# Altium schematic sheet DMB.SchDoc
size A3; SheetNumber: 1; SheetTotal: 2
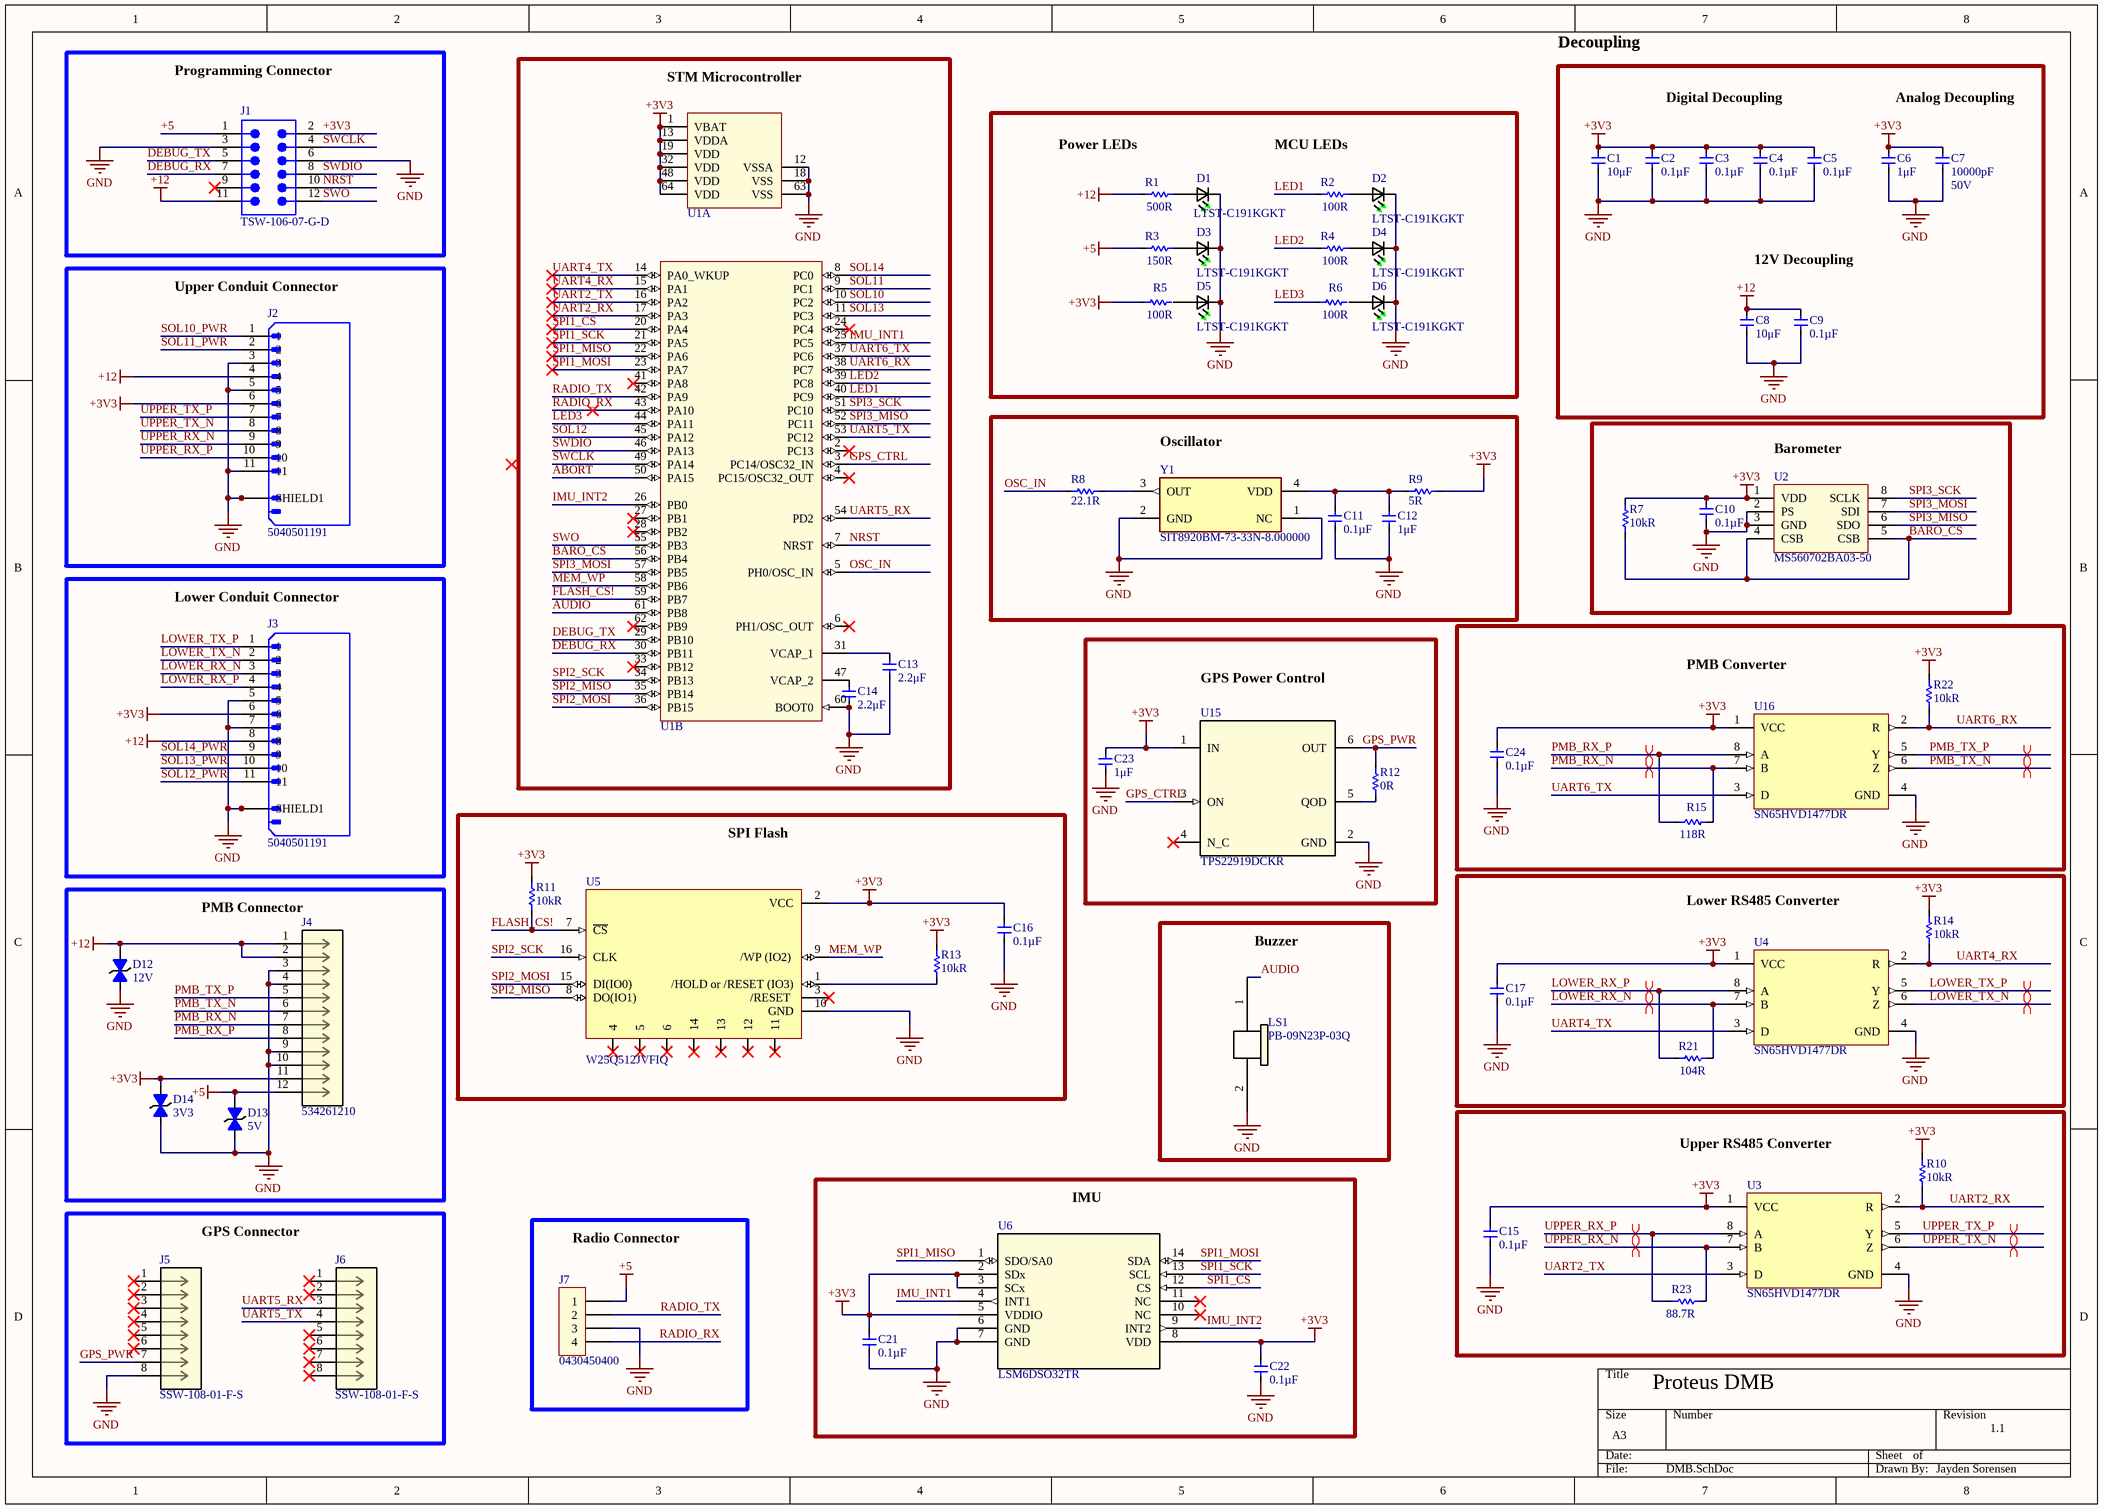
[diagram p0: DMB.SchDoc]

## Parts
C1  10μF  [0603]
C2  Capacitance: 0.1µF  [0603]  (hidden comment: CGA3E2X7R1E104K080AA)
C3  Capacitance: 0.1µF  [0603]  (hidden comment: CGA3E2X7R1E104K080AA)
C4  Capacitance: 0.1µF  [0603]  (hidden comment: CGA3E2X7R1E104K080AA)
C5  Capacitance: 0.1µF  [0603]  (hidden comment: CGA3E2X7R1E104K080AA)
C6  1μF  [0603]
C7  Capacitance: 10000pF  Voltage - Rated: 50V  [0603]  (hidden comment: CGA3E2X7R1H103K080AA)
C8  10μF  [0603]
C9  Capacitance: 0.1µF  [0603]  (hidden comment: CGA3E2X7R1E104K080AA)
C10  Capacitance: 0.1µF  [0603]  (hidden comment: CGA3E2X7R1E104K080AA)
C11  Capacitance: 0.1µF  [0603]  (hidden comment: CGA3E2X7R1E104K080AA)
C12  1μF  [0603]
C13  2.2μF  [0603]
C14  2.2μF  [0603]
C15  Capacitance: 0.1µF  [0603]  (hidden comment: CGA3E2X7R1E104K080AA)
C16  Capacitance: 0.1µF  [0603]  (hidden comment: CGA3E2X7R1E104K080AA)
C17  Capacitance: 0.1µF  [0603]  (hidden comment: CGA3E2X7R1E104K080AA)
C21  Capacitance: 0.1µF  [0603]  (hidden comment: CGA3E2X7R1E104K080AA)
C22  Capacitance: 0.1µF  [0603]  (hidden comment: CGA3E2X7R1E104K080AA)
C23  1μF  [0603]
C24  Capacitance: 0.1µF  [0603]  (hidden comment: CGA3E2X7R1E104K080AA)
D1  LTST-C191KGKT  [LED_LTST-C191KGKT_LTO]
D2  LTST-C191KGKT  [LED_LTST-C191KGKT_LTO]
D3  LTST-C191KGKT  [LED_LTST-C191KGKT_LTO]
D4  LTST-C191KGKT  [LED_LTST-C191KGKT_LTO]
D5  LTST-C191KGKT  [LED_LTST-C191KGKT_LTO]
D6  LTST-C191KGKT  [LED_LTST-C191KGKT_LTO]
D12  12V  [SOD-323-2]
D13  5V  [SOD-323-2]
D14  3V3  [SOD-323-2]
J1  TSW-106-07-G-D  [SMTC-TSW-106-07-X-D]
J2  5040501191  [MOLEX_5040501191]
J3  5040501191  [MOLEX_5040501191]
J4  534261210  [2159321270]
J5  SSW-108-01-F-S  [CON8_1X8_TU_SSQ]
J6  SSW-108-01-F-S  [CON8_1X8_TU_SSQ]
J7  0430450400  [0430450400]
LS1  PB-09N23P-03Q  [PB-09N23P-03Q]
R1  500R  [0603]
R2  100R  [0603]
R3  150R  [0603]
R4  100R  [0603]
R5  100R  [0603]
R6  100R  [0603]
R7  10kR  [0603]
R8  22.1R  [0603]
R9  Resistance: 5R  [BO_PWR2010]  (hidden comment: PWR2010W5R00JE)
R10  10kR  [0603]
R11  10kR  [0603]
R12  0R  [0603]
R13  10kR  [0603]
R14  10kR  [0603]
R15  118R  [0603]
R21  104R  [0603]
R22  10kR  [0603]
R23  88.7R  [0603]
U1  STM32F405RGT6  [TSQFP50P1200X1200X160-64N]  (value not drawn)  (parts A,B of 2)
U2  MS560702BA03-50  [TECO-MS560702BA03-50_V]
U3  SN65HVD1477DR  [SOIC127P600X175-8N]
U4  SN65HVD1477DR  [SOIC127P600X175-8N]
U5  W25Q512JVFIQ  [SOIC127P1030X265-16N]
U6  LSM6DSO32TR  [LSM6DSO32TR]
U15  TPS22919DCKR  [SC-70-6]
U16  SN65HVD1477DR  [SOIC127P600X175-8N]
Y1  SIT8920BM-73-33N-8.000000  [FP-SIT8920BM-73-33N-8_000-MFG]

## Blocks framed on the sheet
Programming Connector: J1
STM Microcontroller: C13 C14 U1
Decoupling: C1-C9
Upper Conduit Connector: J2
Oscillator: C11 C12 R8 R9 Y1
Barometer: C10 R7 U2
Lower Conduit Connector: J3
GPS Power Control: C23 R12 U15
PMB Converter: C24 R15 R22 U16
SPI Flash: C16 R11 R13 U5
Lower RS485 Converter: C17 R14 R21 U4
PMB Connector: D12-D14 J4
Buzzer: LS1
Upper RS485 Converter: C15 R10 R23 U3
IMU: C21 C22 U6
GPS Connector: J5 J6
Radio Connector: J7

## Nets
+3V3: C1.2 C2.2 C3.2 C4.2 C5.2 C6.2 C7.2 C10.2 C15.2 C16.2 C17.2 C21.2 C22.2 C23.2 C24.2 D14.1 J1.2 J2.6 J3.6 J4.11 R5.1 R7.2 R9.2 R10.2 R11.2 R13.2 R14.2 R22.2 U1.1(VBAT) U1.13(VDDA) U1.19(VDD) U1.32(VDD) U1.48(VDD) U1.64(VDD) U2.1(VDD) U3.1(VCC) U4.1(VCC) U5.2(VCC) U6.2(SDx) U6.3(SCx) U6.5(VDDIO) U6.8(VDD) U15.1(IN) U16.1(VCC)
+5: D13.2 J1.1 J4.12 J7.1 R3.1
+12: C8.2 C9.2 D12.2 J1.11 J2.4 J3.8 J4.1 J4.2 R1.1
GND: C1.1 C2.1 C3.1 C4.1 C5.1 C6.1 C7.1 C8.1 C9.1 C10.1 C11.1 C12.1 C13.1 C14.1 C15.1 C16.1 C17.1 C21.1 C22.1 C23.1 C24.1 D1.1(K2) D2.1(K2) D3.1(K2) D4.1(K2) D5.1(K2) D6.1(K2) D12.1 D13.1 D14.2 J1.3 J1.6 J2.3 J2.5 J2.11 J2.S1(SHIELD1) J2.S2(SHIELD1) J3.5 J3.7 J3.S1(SHIELD1) J3.S2(SHIELD1) J4.3 J4.4 J4.9 J4.10 J5.8 J7.3 LS1.2 U1.12(VSSA) U1.18(VSS) U1.60(BOOT0) U1.63(VSS) U2.2(PS) U2.3(GND) U3.4(GND) U4.4(GND) U5.10(GND) U6.6(GND) U6.7(GND) U15.2(GND) U16.4(GND) Y1.1(NC) Y1.2(GND)
ABORT: U1.50(PA15)
AUDIO: LS1.1 U1.61(PB8)
BARO_~{CS}: R7.1 U1.56(PB4) U2.4(CSB) U2.5(CSB)
DEBUG_RX: J1.7 U1.30(PB11)
DEBUG_TX: J1.5 U1.29(PB10)
FLASH_CS!: R11.1 U1.59(PB7) U5.7(~{CS})
GPS_CTRL: U1.3(PC14/OSC32_IN) U15.3(ON)
GPS_PWR: J5.7 R12.2 U15.6(OUT)
IMU_INT1: U1.25(PC5) U6.4(INT1)
IMU_INT2: U1.26(PB0) U6.9(INT2)
LED1: R2.1 U1.40(PC9)
LED2: R4.1 U1.39(PC8)
LED3: R6.1 U1.44(PA11)
LOWER_RX_N: J3.3 R21.2 U4.7(B)
LOWER_RX_P: J3.4 R21.1 U4.8(A)
LOWER_TX_N: J3.2 U4.6(Z)
LOWER_TX_P: J3.1 U4.5(Y)
MEM_WP: U1.58(PB6) U5.9(/WP_(IO2))
NRST: J1.10 U1.7(NRST)
OSC_IN: R8.1 U1.5(PH0/OSC_IN)
PMB_RX_N: J4.7 R15.2 U16.7(B)
PMB_RX_P: J4.8 R15.1 U16.8(A)
PMB_TX_N: J4.6 U16.6(Z)
PMB_TX_P: J4.5 U16.5(Y)
RADIO_RX: J7.4 U1.43(PA10)
RADIO_TX: J7.2 U1.42(PA9)
SOL10: U1.10(PC2)
SOL10_PWR: J2.1
SOL11: U1.9(PC1)
SOL11_PWR: J2.2
SOL12: U1.45(PA12)
SOL12_PWR: J3.11
SOL13: U1.11(PC3)
SOL13_PWR: J3.10
SOL14: U1.8(PC0)
SOL14_PWR: J3.9
SPI1_CS: U1.20(PA4) U6.12(CS)
SPI1_MISO: U1.22(PA6) U6.1(SDO/SA0)
SPI1_MOSI: U1.23(PA7) U6.14(SDA)
SPI1_SCK: U1.21(PA5) U6.13(SCL)
SPI2_MISO: U1.35(PB14) U5.8(DO(IO1))
SPI2_MOSI: U1.36(PB15) U5.15(DI(IO0))
SPI2_SCK: U1.34(PB13) U5.16(CLK)
SPI3_MISO: U1.52(PC11) U2.6(SDO)
SPI3_MOSI: U1.57(PB5) U2.7(SDI)
SPI3_SCK: U1.51(PC10) U2.8(SCLK)
SWCLK: J1.4 U1.49(PA14)
SWDIO: J1.8 U1.46(PA13)
SWO: J1.12 U1.55(PB3)
UART2_RX: R10.1 U1.17(PA3) U3.2(R)
UART2_TX: U1.16(PA2) U3.3(D)
UART4_RX: R14.1 U1.15(PA1) U4.2(R)
UART4_TX: U1.14(PA0_WKUP) U4.3(D)
UART5_RX: J6.3 U1.54(PD2)
UART5_TX: J6.4 U1.53(PC12)
UART6_RX: R22.1 U1.38(PC7) U16.2(R)
UART6_TX: U1.37(PC6) U16.3(D)
UPPER_RX_N: J2.9 R23.2 U3.7(B)
UPPER_RX_P: J2.10 R23.1 U3.8(A)
UPPER_TX_N: J2.8 U3.6(Z)
UPPER_TX_P: J2.7 U3.5(Y)
NetC11_2: C11.2 C12.2 R9.1 Y1.4(VDD)
NetC13_2: C13.2 U1.31(VCAP_1)
NetC14_2: C14.2 U1.47(VCAP_2)
NetD1_2: D1.2(A2) R1.2
NetD2_2: D2.2(A2) R2.2
NetD3_2: D3.2(A2) R3.2
NetD4_2: D4.2(A2) R4.2
NetD5_2: D5.2(A2) R5.2
NetD6_2: D6.2(A2) R6.2
NetR8_2: R8.2 Y1.3(OUT)
NetR12_1: R12.1 U15.5(QOD)
NetR13_1: R13.1 U5.1(/HOLD_or_/RESET_(IO3))

Not connected (* = marked no-connect by the designer): J1 9*; J5 1* 2* 3* 4* 5* 6*; J6 1* 2* 5* 6* 7* 8*; U1 2(PC13)* 4(PC15/OSC32_OUT)* 6(PH1/OSC_OUT)* 24(PC4)* 27(PB1)* 28(PB2)* 33(PB12)* 41(PA8)* 62(PB9)*; U5 3(/RESET_)* ?1(4)* ?2(5)* ?3(6)* ?4(11)* ?5(12)* ?6(13)* ?7(14)*; U6 10(NC)* 11(NC)*; U15 4(N_C)*

## Layout directives
differential pair; net class LOWER_TX; differential pair class CONDUIT: LOWER_TX_N, LOWER_TX_P, PMB_TX_N, PMB_TX_P
differential pair; net class UPPER_TX; differential pair class CONDUIT: UPPER_TX_N, UPPER_TX_P
differential pair; net class UPPER_RX; differential pair class CONDUIT: UPPER_RX_N, UPPER_RX_P
differential pair; net class LOWER_RX; differential pair class CONDUIT: LOWER_RX_N, LOWER_RX_P, PMB_RX_N, PMB_RX_P

## Notes on the sheet
- Digital Decoupling
- Analog Decoupling
- (near R1) Power LEDs
- MCU LEDs
- 12V Decoupling
- Proteus DMB
- 1.1
- Jayden Sorensen

## Library data of the parts
C1 C8 = CL10A106MP8NNNC: CAP CER 10UF 10V X5R 0603
C2-C5 C9-C11 C15-C17 C21 C22 C24 = CGA3E2X7R1E104K080AA: CAP CER 0.1UF 25V X7R 0603; Manufacturer: TDK Corporation; Tolerance: ±10%; Temperature Coefficient: X7R; Operating Temperature: -55°C ~ 125°C; Mounting Type: Surface Mount, MLCC; Package / Case: 0603 (1608 Metric); Size / Dimension: 0.063" L x 0.031" W (1.60mm x 0.80mm); Manufacturer Part Number: CGA3E2X7R1E104K080AA; Thickness (Max): 0.035" (0.90mm); ComponentLink1Description: Datasheet; ComponentLink1URL: https://product.tdk.com/info/en/catalog/spec/mlccspec_automotive_general_en.pdf; Supplier 1: Digi-Key; Supplier Part Number 1: 445-5667-1-ND
C6 C12 C23 = CL10A105KP8NNNC: CAP CER 1UF 10V X5R 0603
C7 = CGA3E2X7R1H103K080AA: CAP CER 10000PF 50V X7R 0603; Manufacturer: TDK Corporation; Tolerance: ±10%; Temperature Coefficient: X7R; Operating Temperature: -55°C ~ 125°C; Mounting Type: Surface Mount, MLCC; Package / Case: 0603 (1608 Metric); Size / Dimension: 0.063" L x 0.031" W (1.60mm x 0.80mm); Manufacturer Part Number: CGA3E2X7R1H103K080AA; Thickness (Max): 0.035" (0.90mm); ComponentLink1Description: Datasheet; ComponentLink1URL: https://product.tdk.com/info/en/catalog/spec/mlccspec_automotive_general_en.pdf; Supplier 1: Digi-Key; Supplier Part Number 1: 445-5662-1-ND
C13 C14 = C1608X5R1C225K080AB: CAP CER 2.2UF 16V X5R 0603
D1-D6 = LTST-C191KGKT: LED GREEN CLEAR SMD 0603
D12 = SD12C-01FTG: TVS 12V Working, 23V Clamp - ESD Suppressor Diode TVS Bi-Dir 12V Automotive 2-Pin SOD-323 T/R; Manufacturer: Littelfuse; Number of Bidirectional Channels: 1; Peak Pulse Power: 450W; Power Line Protection: No; Polarity: Bidirectional; Max Surge Current: 17A; Supplier 1: RSComponents; Supplier Part Number 1: 1719641; Manufacturer Part Number: SD12C-01FTG; RoHS: Yes; Category: TVS Diodes; Stock: 2350; Pricing: 25=0.37600, 100=0.31400, 500=0.30600, 1000=0.29900 (GBP); Mount: Surface Mount; Case/Package: SOD; Number of Pins: 2; Min Operating Temperature: -40°C; Max Operating Temperature: 125°C; Packaging: Tape and Reel; Reverse Standoff Voltage: 12V; Clamping Voltage: 23V; Termination: SMD/SMT; Working Voltage: 12V; Max Power Dissipation: 450W; Package Quantity: 3000; Peak Pulse Current: 17A; Resistor Type: Zener; RoHS Compliant: Yes; ComponentLink1URL: http://www.mouser.com/ds/2/240/littelfuse_SD-C_datasheet-341330.pdf?src-supplier=Mouser; ComponentLink1Description: http://www.mouser.com/ds/2/240/littelfuse_SD-C_datasheet-341330.pdf?src-supplier=Mouser; ComponentLink2URL: http://www.farnell.com/datasheets/2244591.pdf?src-supplier=Farnell; ComponentLink2Description: http://www.farnell.com/datasheets/2244591.pdf?src-supplier=Farnell; ComponentLink3URL: http://www.littelfuse.com/~/media/electronics/datasheets/tvs_diode_arrays/littelfuse_tvs_diode_array_sd_c_datasheet.pdf.pdf?src-supplier=Digi-Key; ComponentLink3Description: http://www.littelfuse.com/~/media/electronics/datasheets/tvs_diode_arrays/littelfuse_tvs_diode_array_sd_c_datasheet.pdf.pdf?src-supplier=Digi-Key; ComponentLink4URL: http://www.farnell.com/datasheets/2244591.pdf?src-supplier=Newark; ComponentLink4Description: http://www.farnell.com/datasheets/2244591.pdf?src-supplier=Newark
D13 = SP4021-01FTG-C: TVS 5V Working, 19.6V Clamp - ESD Protection Diodes / TVS Diodes 2.5pF 25A BI for Surge Protection
D14 = CDSOD323-T03SC: TVS 3.3V Working, 10.9V Clamp - 10.9V (Typ) Clamp 43A (8/20µs) Ipp Tvs Diode Surface Mount SOD-323; Manufacturer: Bourns; Direction: Bidirectional; Capacitance: 200pF; Breakdown Voltage: 4V; Number of Channels: 1; Peak Pulse Power: 400W; Power Line Protection: No; Leakage Current: 125uA; Element Configuration: Single; Diode Type: ZENER; Supplier 1: RSComponents; Supplier Part Number 1: 1742507P; Manufacturer Part Number: CDSOD323-T03SC; RoHS: Yes; Category: TVS Diodes; Stock: 32820; Pricing: 100=0.46700, 500=0.38800, 1000=0.31100, 2000=0.28800 (GBP); Mount: Surface Mount; Number of Pins: 2; Contact Plating: Tin; Min Operating Temperature: -55°C; Max Operating Temperature: 150°C; Clamping Voltage: 10.9V; Working Voltage: 3.3V; Operating Supply Voltage: 3.3V; Max Surge Current: 43A; Packaging: Tape and Reel; Package Quantity: 3000; Polarity: Bidirectional; Termination: SMD/SMT; Reverse Standoff Voltage: 3.3V; Min Breakdown Voltage: 4V; Max Power Dissipation: 400W; Peak Pulse Current: 43A; Resistor Type: Zener; Series: CDSOD323; Number of Bidirectional Channels: 1; Length: 1.9mm; Depth: 1.45mm; Radiation Hardening: No; REACH SVHC: No SVHC; ComponentLink1URL: https://datasheet.ciiva.com/15063/cdsod323-txxsc-15063768.pdf?src-supplier=Digi-Key; ComponentLink1Description: https://datasheet.ciiva.com/15063/cdsod323-txxsc-15063768.pdf?src-supplier=Digi-Key; ComponentLink2URL: https://datasheet.ciiva.com/15063/cdsod323-txxsc-15063769.pdf?src-supplier=Digi-Key; ComponentLink2Description: https://datasheet.ciiva.com/15063/cdsod323-txxsc-15063769.pdf?src-supplier=Digi-Key; ComponentLink3URL: https://datasheet.ciiva.com/15063/cdsod323-txxsc-15063770.pdf?src-supplier=Digi-Key; ComponentLink3Description: https://datasheet.ciiva.com/15063/cdsod323-txxsc-15063770.pdf?src-supplier=Digi-Key; ComponentLink4URL: https://datasheet.ciiva.com/22685/1671000-22685542.pdf?src-supplier=Element14; ComponentLink4Description: https://datasheet.ciiva.com/22685/1671000-22685542.pdf?src-supplier=Element14
J1 = CMP-1024-00379-1: 0.025" SQ Post Header, Through-hole, Vertical, -55 to 125 degC, 2.54 mm Pitch, 12-Pin, Male, RoHS; Manufacturer: Samtec; Pitch: 2.54 mm; ComponentLink1URL: http://www.samtec.com; DatasheetVersion: F-214; ComponentLink3URL: http://www.samtec.com/documents/webfiles/cpdf/TSW-XXX-XX-XXX-X-XX-XXX-MKT.pdf; PackageVersion: DM, 8/1988; Mounting Technology: Through-hole; ComponentLink1Description: Manufacturer URL; Orientation: Vertical; PackageDescription: .025[0.64] SQ. Post Terminal Strip Assembly; ComponentLink2URL: http://www.samtec.com/documents/webfiles/pdf/TSW_TH.PDF; RoHS: True; ComponentLink3Description: Package Specification; ComponentLink2Description: Datasheet; PackageReference: TSW-106-07-X-D; Temperature Range: -55 to 125 degC; PartNumber: TSW-106-07-G-D
J2 J3 = 5040501191: 11-pin Pico Lock Right-Angle PCB header; Price: None; Availability: Unavailable; MP: 5040501191; Value: *; Package: None
J4 = 534261210: CONN HEADER R/A 12POS 2.5MM; Mfr_Name: Molex Connector Corporation; RefDes: RefDes; Type: Type
J5 J6 = SSW-108-01-F-S: PCB Receptacle, Board-to-Board, 2.54 mm, 1 Rows, 8 Contacts
J7 = 0430450400: CONN HEADER R/A 4POS 3MM
LS1 = PB-09N23P-03Q: Buzzers Indicator, Internally Driven Magnetic 3 V 30mA 2.7kHz 82dB @ 3V, 10cm Through Hole PC Pins; Mfr_Name: Mallory Sonalert; RefDes: RefDes; Type: Type
R1 R2 = RT0603BRD07500RL: RES 500 OHM 0.1% 1/10W 0603
R3 R4 = RMCF0603FT150R: RES 150 OHM 1% 1/10W 0603
R5 R6 = ERJ-3EKF1000V: RES SMD 100 OHM 1% 1/10W 0603
R7 R10 R11 R13 R14 R22 = ERJ-3GEYJ103V: RES SMD 10K OHM 5% 1/10W 0603
R8 = ERJ-P03F22R1V: Thick Film Resistors - SMD 0603 22.1ohms 0.2W 1% AEC-Q200
R9 = PWR2010W5R00JE: Res Wirewound 2010 5 Ohm 5% 1/2W ±50ppm/°C Molded SMD SMD T/R; Manufacturer: Bourns; Power Rating: 500mW; Threshold Voltage: 1.6V; Supplier 1: Newark; Supplier Part Number 1: 05R8093; Manufacturer Part Number: PWR2010W5R00JE; RoHS: Yes; Category: Chip SMD Resistors; Stock: 26; Pricing: 1=0.68700, 10=0.68700, 25=0.68700, 50=0.68700, 100=0.68700, 250=0.68700 (CAD); Mount: Surface Mount; Case/Package: 2010; Number of Pins: 2; Case Code (Metric): 5025; Case Code (Imperial): 2010; Min Operating Temperature: -55°C; Max Operating Temperature: 155°C; Tolerance: 5%; Resistor Type: Wirewound; Temperature Coefficient: 50ppm/°C; Packaging: Cut Tape; Package Quantity: 1; Number of Terminations: 2; Termination: Solder; Max Power Dissipation: 500mW; Series: PWR2010; Resistance Tolerance: 5%; Technology: WIRE WOUND; Length: 0.2inch; Width: 0.1inch; Height: 0.148inch; Depth: 2.54mm; Reach SVHC Compliant: Yes; Military Standard: Not; ComponentLink1URL: https://datasheet.ciiva.com/7986/1727932-7986277.pdf?src-supplier=Element14; ComponentLink1Description: https://datasheet.ciiva.com/7986/1727932-7986277.pdf?src-supplier=Element14; ComponentLink2URL: https://datasheet.ciiva.com/22713/1727932-22713400.pdf?src-supplier=Element14; ComponentLink2Description: https://datasheet.ciiva.com/22713/1727932-22713400.pdf?src-supplier=Element14; ComponentLink3URL: https://datasheet.ciiva.com/9122/pwr2010-9122735.pdf?src-supplier=Avnet; ComponentLink3Description: https://datasheet.ciiva.com/9122/pwr2010-9122735.pdf?src-supplier=Avnet; ComponentLink4URL: https://datasheet.ciiva.com/15865/pwr2010-15865624.pdf?src-supplier=Onlinecomponents.com; ComponentLink4Description: https://datasheet.ciiva.com/15865/pwr2010-15865624.pdf?src-supplier=Onlinecomponents.com; ComponentLink5URL: https://datasheet.ciiva.com/2484/pwr2010-2484257.pdf?src-supplier=Digi-Key; ComponentLink5Description: https://datasheet.ciiva.com/2484/pwr2010-2484257.pdf?src-supplier=Digi-Key; ComponentLink6URL: https://datasheet.ciiva.com/2484/pwr2010-2484258.pdf?src-supplier=Digi-Key; ComponentLink6Description: https://datasheet.ciiva.com/2484/pwr2010-2484258.pdf?src-supplier=Digi-Key; ComponentLink7URL: https://datasheet.ciiva.com/2484/pwr2010-2484256.pdf?src-supplier=Digi-Key; ComponentLink7Description: https://datasheet.ciiva.com/2484/pwr2010-2484256.pdf?src-supplier=Digi-Key
R12 = RC0603JR-070RL: Thick Film Resistors - SMD 0 Ohms 100 mW 0603 5%
R15 = ERJ-3EKF1180V: RES SMD 118 OHM 1% 1/10W 0603
R21 = RT0603BRD07104RL: RES SMD 104 OHM 0.1% 1/10W 0603
R23 = CRCW060388R7FKEA: RES SMD 88.7 OHM 1% 1/10W 0603
U1 = STM32F405RGT6: IC MCU 32BIT 1MB FLASH 64LQFP; Manufacturer: STMicroelectronics; Core Processor: ARM® Cortex®-M4; Core Size: 32-Bit; Speed: 168MHz; Connectivity: CANbus, I²C, IrDA, LINbus, SPI, UART/USART, USB OTG; Peripherals: Brown-out Detect/Reset, DMA, I²S, LCD, POR, PWM, WDT; Number of I/O: 51; Program Memory Size: 1MB (1M x 8); RAM Size: 192K x 8; Voltage - Supply (VDD): 1.8V ~ 3.6V; Data Converters: A/D 16x12b; D/A 2x12b; Oscillator Type: Internal; ComponentLink1Description: Datasheet; ComponentLink1URL: https://www.st.com/content/ccc/resource/technical/document/datasheet/ef/92/76/6d/bb/c2/4f/f7/DM00037051.pdf/files/DM00037051.pdf/jcr:content/translations/en.DM00037051.pdf; Program Memory Type: FLASH; Manufacturer Part Number: STM32F405RGT6; Operating Temperature: -40°C ~ 85°C (TA); Mounting Type: Surface Mount; Package / Case: 64-LQFP; Supplier 1: Digi-Key; Supplier Part Number 1: 497-11767-ND
U2 = MS560702BA03-50: BAROMETRIC PRESSURE SENSOR
U3 U4 U16 = SN65HVD1477DR: 3.3V, Full-Duplex RS-485, 16kV IEC ESD, 50Mbps data rate, No Enables 8-SOIC -40 to 125
U5 = W25Q512JVFIQ: IC Flash 512MBIT Spi/quad 16SOIC
U6 = LSM6DSO32TR: 6-axis IMU, 3-axis accelerometer and 3-axis gyroscope
U15 = TPS22919DCKR: 5.5-V, 1.5-A, 90-mΩ load switch with adj. output discharge 6-SC70 -40 to 105
Y1 = CMP-25149-000010-1: MEMS OSC XO 8.0000MHZ LVCM LVTTL